# EAGLE design transponder_2018_v3 (EAGLE 9.1.3)
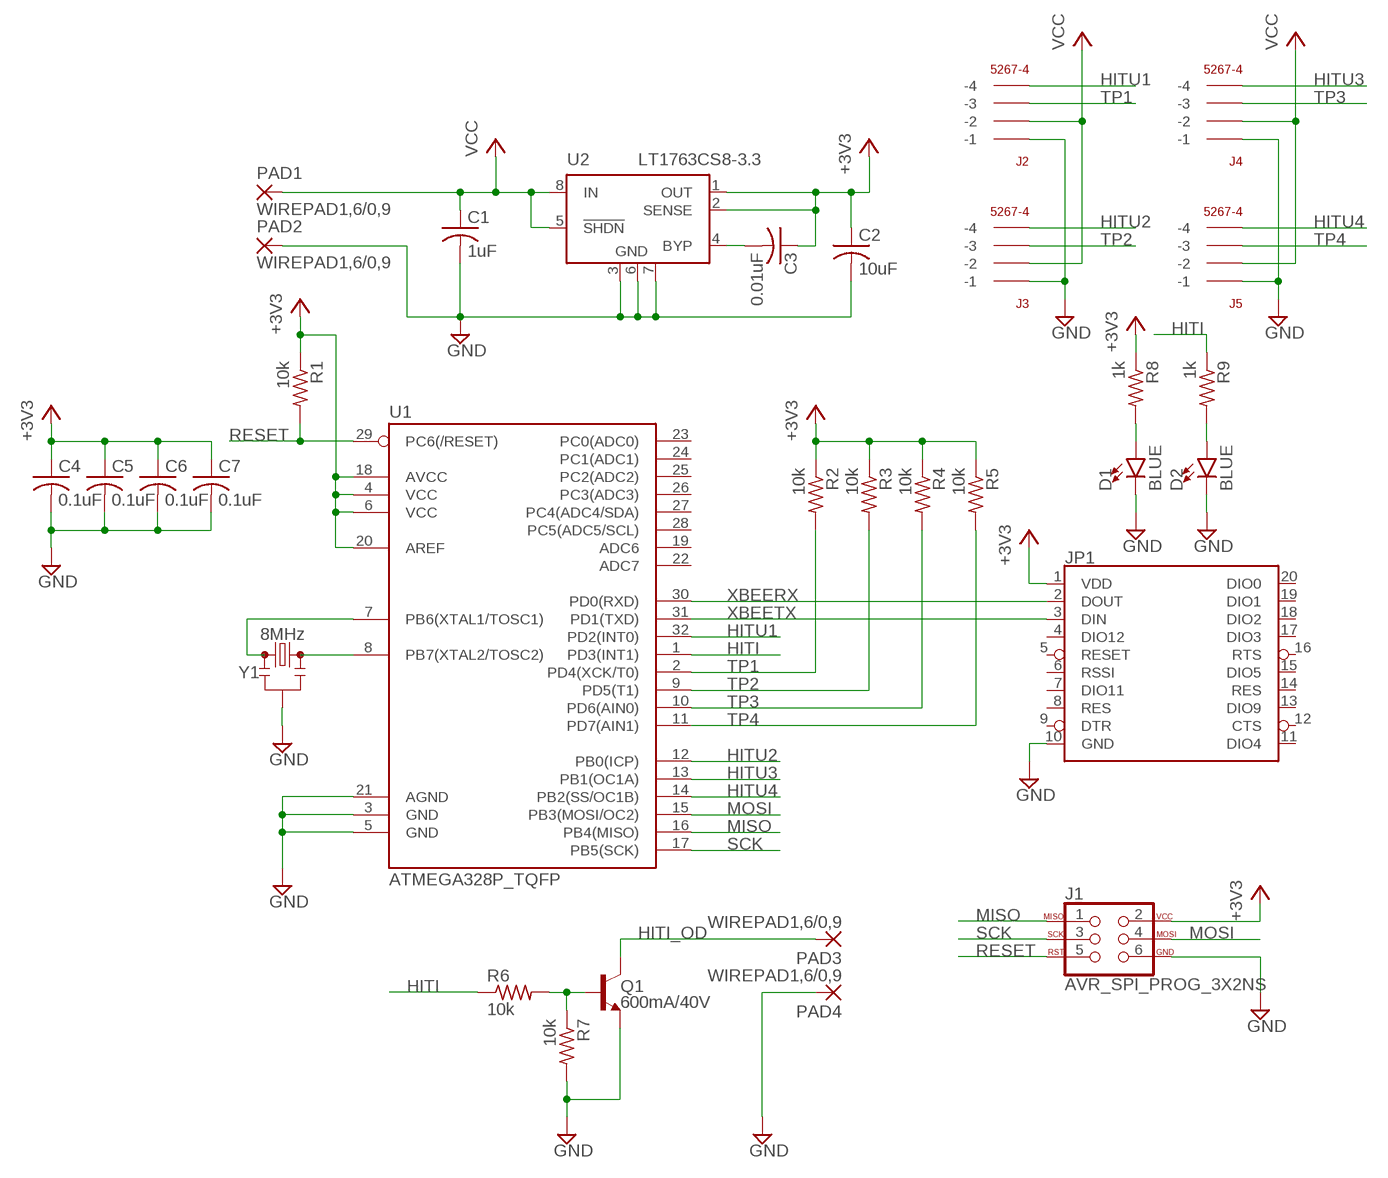
[diagram p0: schematic, sheet 1]

## Parts
C1  1uF  C-USC0603  [C0603]
C2  10uF  C-USC1206  [C1206]
C3  0.01uF  C-USC0603  [C0603]
C4  0.1uF  C-USC0603  [C0603]
C5  0.1uF  C-USC0603  [C0603]
C6  0.1uF  C-USC0603  [C0603]
C7  0.1uF  C-USC0603  [C0603]
D1  BLUE  LED-BLUE0603  [LED-0603]
D2  BLUE  LED-BLUE0603  [LED-0603]
J1  AVR_SPI_PROG_3X2NS  [2X3-NS]
J2  5267-4  [5267-4]
J3  5267-4  [5267-4]
J4  5267-4  [5267-4]
J5  5267-4  [5267-4]
JP1  XBEESMD  [XBEE-SMD]
PAD1  WIREPAD1,6/0,9  [1,6/0,9]
PAD2  WIREPAD1,6/0,9  [1,6/0,9]
PAD3  WIREPAD1,6/0,9  [1,6/0,9]
PAD4  WIREPAD1,6/0,9  [1,6/0,9]
Q1  600mA/40V  TRANS_NPN-MMBT2222AL  [SOT23-3]
R1  10k  R-US_R0603  [R0603]
R2  10k  R-US_R0603  [R0603]
R3  10k  R-US_R0603  [R0603]
R4  10k  R-US_R0603  [R0603]
R5  10k  R-US_R0603  [R0603]
R6  10k  R-US_R0603  [R0603]
R7  10k  R-US_R0603  [R0603]
R8  1k  R-US_R0603  [R0603]
R9  1k  R-US_R0603  [R0603]
U1  ATMEGA328P_TQFP  [TQFP32-08]
U2  LT1763CS8-3.3  [SOIC8]
Y1  8MHz  RESONATOR-8MHZSMD_3.2X1.3  [RESONATOR-SMD-3.2X1.3]

## Nets
+3V3: C2.1 C3.1 C4.1 C5.1 C6.1 C7.1 J1.2 JP1.1(VDD) R1.1 R2.1 R3.1 R4.1 R5.1 R8.1 U1.4(VCC) U1.6(VCC) U1.18(AVCC) U1.20(AREF) U2.1(OUT) U2.2(SENSE)
GND: C1.2 C2.2 C4.2 C5.2 C6.2 C7.2 D1.C D2.C J1.6 J2.P$1(-1) J3.P$1(-1) J4.P$1(-1) J5.P$1(-1) JP1.10(GND) PAD2.1(P) PAD4.1(P) Q1.2(E) R7.2 U1.3(GND) U1.5(GND) U1.21(AGND) U2.3(GND) U2.6(GND) U2.7(GND) Y1.2
HITI: R6.1 R9.1 U1.1(PD3(INT1))
HITI_OD: PAD3.1(P) Q1.3(C)
HITU1: J2.P$4(-4) U1.32(PD2(INT0))
HITU2: J3.P$4(-4) U1.12(PB0(ICP))
HITU3: J4.P$4(-4) U1.13(PB1(OC1A))
HITU4: J5.P$4(-4) U1.14(PB2(SS/OC1B))
MISO: J1.1 U1.16(PB4(MISO))
MOSI: J1.4 U1.15(PB3(MOSI/OC2))
N$1: U1.8(PB7(XTAL2/TOSC2)) Y1.3
N$2: U1.7(PB6(XTAL1/TOSC1)) Y1.1
N$3: D1.A R8.2
N$4: Q1.1(B) R6.2 R7.1
N$5: D2.A R9.2
N$6: C3.2 U2.4(BYP)
RESET: J1.5 R1.2 U1.29(PC6(/RESET))
SCK: J1.3 U1.17(PB5(SCK))
TP1: J2.P$3(-3) R2.2 U1.2(PD4(XCK/T0))
TP2: J3.P$3(-3) R3.2 U1.9(PD5(T1))
TP3: J4.P$3(-3) R4.2 U1.10(PD6(AIN0))
TP4: J5.P$3(-3) R5.2 U1.11(PD7(AIN1))
VCC: C1.1 J2.P$2(-2) J3.P$2(-2) J4.P$2(-2) J5.P$2(-2) PAD1.1(P) U2.5(!SHDN) U2.8(IN)
XBEERX: JP1.2(DOUT) U1.30(PD0(RXD))
XBEETX: JP1.3(DIN) U1.31(PD1(TXD))
Unconnected: JP1.4(DIO12) JP1.5(RESET) JP1.6(RSSI) JP1.7(DIO11) JP1.8(RES) JP1.9(DTR) JP1.11(DIO4) JP1.12(CTS) JP1.13(DIO9) JP1.14(RES) JP1.15(DIO5) JP1.16(RTS) JP1.17(DIO3) JP1.18(DIO2) JP1.19(DIO1) JP1.20(DIO0) U1.19(ADC6) U1.22(ADC7) U1.23(PC0(ADC0)) U1.24(PC1(ADC1)) U1.25(PC2(ADC2)) U1.26(PC3(ADC3)) U1.27(PC4(ADC4/SDA)) U1.28(PC5(ADC5/SCL))

## Library data of the parts
C1-C7 = resistor:C-US: CAPACITOR, American symbol
D1 D2 = SparkFun-LED:LED-BLUE: Blue SMD LED Used in manufacturing of various products at SparkFun Packages: 0603 - SMD 0603 package [Product Link] <http://www.digikey.com/product-detail/en/SMLE12BC7TT86/511-1589-2-ND/1641808> 1206 - SMD1206 package [Product Link] <http://www.digikey.com/product-detail/en/lite-on-inc/LTST-C150TBKT/160-1643-1-ND/573584> SparkFun Products: ESP8266 Thing-Dev Board <https://www.sparkfun.com/products/13711> RedBoard <https://www.sparkfun.com/products/12757>; PROD_ID: DIO-08575
J1 = SparkFun-Connectors:AVR_SPI_PROG_3X2: AVR ISP 6 Pin This is the reduced ISP connector for AVR programming. Common on Arduino. This footprint will take up less PCB space and can be used with a 10-pin to 6-pin adapter such as SKU: BOB-08508 **Special note about "TEST_POINT" package. The stop mask is on the top side, so if you want your programming test points to be on the bottom of your board, make sure to place this package on the bottom side of the board. This also ensure that the orientation to program from the bottom side will be correct. SparkFun Products: SparkFun ISP Pogo Adapter <https://www.sparkfun.com/products/11591> - NS Tiny AVR Programmer <https://www.sparkfun.com/products/11801> -PTH
J2-J5 = con-molex-spox:5267-4
JP1 = SparkFun-RF:XBEE: Digi XBee and XBee Pro XBees are tiny blue chips that can communicate wirelessly with each other. They can do simple things, like replacing a couple of wires in serial communication, which is nice when you want to make a remote for your paintball vehicle. SparkFun Products SparkFun XBee Buying Guide <https://www.sparkfun.com/pages/xbee_guide> SparkFun XBee Explorer USB <https://www.sparkfun.com/products/11812> (WRL-11812) Breakout Board for XBee Module <https://www.sparkfun.com/products/8276> (WRL-8276) SparkFun XBee Explorer Regulated <https://www.sparkfun.com/products/11373> (WRL-11373) SparkFun XBee Explorer Dongle <https://www.sparkfun.com/products/11697> (WRL-11697) SparkFun XBee Shield <https://www.sparkfun.com/products/12847> (WRL-12847) SparkFun XBee Explorer Serial <https://www.sparkfun.com/products/13225> (WRL-13225); PROD_ID: CONN-09042
PAD1-PAD4 = wirepad:WIREPAD: Wire PAD connect wire on PCB
Q1 = SparkFun-DiscreteSemi:TRANS_NPN: NPN transistor Current controlled devices typically used to amplify current or used as a switch. BC547 - COM-08928 <http://www.sparkfun.com/products/8928> (TO-92 45V 100mA) (1.Collector 2.Base 3.Emitter) 2N3904 - COM-00521 <http://www.sparkfun.com/products/521> (TO-92 40V 200mA) (1.Emitter 2.Base 3.Collector) P2N2222A - COM-12852 <http://www.sparkfun.com/products/12852> (TO-92 40V 600mA) (1.Collector 2.Base 3.Emitter); PROD_ID: TRANS-08049
R1-R9 = rcl:R-US_: RESISTOR, American symbol
U1 = SparkFun-IC-Microcontroller:ATMEGA328P_TQFP: Popular 328P in QFP Storefront component: ATmega328 - TQFP <https://www.sparkfun.com/products/13448> (COM-13448) Datasheet <http://www.sparkfun.com/datasheets/Components/SMD/ATMega328.pdf> SparkFun Products SparkFun RedBoard - Programmed with Arduino <https://www.sparkfun.com/products/12757> (DEV-12757) Arduino Pro Mini 328 - 5V/16MHz <https://www.sparkfun.com/products/11113> (DEV-11113) Arduino Pro Mini 328 - 3.3V/8MHz <https://www.sparkfun.com/products/11114> (DEV-11114) SparkFun OpenLog <https://www.sparkfun.com/products/13712> (DEV-13712) SparkFun MicroView - OLED Arduino Module <https://www.sparkfun.com/products/12923> (DEV-12923) SparkFun Digital Sandbox <https://www.sparkfun.com/products/12651> (DEV-12651) SparkFun PicoBoard <https://www.sparkfun.com/products/11888> (WIG-11888) Arduino Fio <https://www.sparkfun.com/products/10116> (DEV-10116) LilyPad Arduino 328 Main Board <https://www.sparkfun.com/products/13342> (DEV-13342) SparkFun RedStick <https://www.sparkfun.com/products/13741> (DEV-13741) LilyPad MP3 <https://www.sparkfun.com/products/11013> (DEV-11013) LilyPad Arduino SimpleSnap <https://www.sparkfun.com/products/10941> (DEV-10941) SparkFun Stepoko <https://www.sparkfun.com/products/13899> (ROB-13899) SparkFun Geiger Counter <https://www.sparkfun.com/products/11345> (SEN-11345) SparkFun EL Sequencer <https://www.sparkfun.com/products/12781> (COM-12781) Arduino Pro 328 - 5V/16MHz <https://www.sparkfun.com/products/10915> (DEV-10915) CryptoCape <https://www.sparkfun.com/products/12773> (DEV-12773) SparkFun IR Thermometer Evaluation Board - MLX90614 <https://www.sparkfun.com/products/10740> (SEN-10740) SparkFun RedBot Mainboard <https://www.sparkfun.com/products/12097> (ROB-12097) Arduino Pro 328 - 3.3V/8MHz <https://www.sparkfun.com/products/10914> (DEV-10914) SparkFun Block for Intel® Edison - Arduino <https://www.sparkfun.com/products/13036> (DEV-13036) SparkFun Simon Says - Surface Mount Soldering Kit <https://www.sparkfun.com/products/10935> (KIT-10935) SparkFun 7-Segment Serial Display - Red <https://www.sparkfun.com/products/11441> (COM-11441) SparkFun 7-Segment Serial Display - White <https://www.sparkfun.com/products/11629> (COM-11629) SparkFun 7-Segment Serial Display - Yellow <https://www.sparkfun.com/products/11443> (COM-11443) SparkFun 7-Segment Serial Display - Kelly Green <https://www.sparkfun.com/products/11440> (COM-11440) SparkFun 7-Segment Serial Display - Blue <https://www.sparkfun.com/products/11442> (COM-11442) SparkFun OpenSegment Serial Display - 20mm (Blue) <https://www.sparkfun.com/products/11647> (COM-11647) SparkFun OpenSegment Serial Display - 20mm (Green) <https://www.sparkfun.com/products/11646> (COM-11646) SparkFun OpenSegment Serial Display - 20mm (White) <https://www.sparkfun.com/products/11648> (COM-11648) SparkFun OpenSegment Serial Display - 20mm (Red) <https://www.sparkfun.com/products/11644> (COM-11644) SparkFun OpenSegment Serial Display - 20mm (Yellow) <https://www.sparkfun.com/products/11645> (COM-11645) SparkFun OpenSegment Shield <https://www.sparkfun.com/products/13190> (DEV-13190); PROD_ID: IC-09069
U2 = linear-technology:LT1763CS8: 500mA, Low Noise, LDO Micropower Regulators Source: http://cds.linear.com/docs/Datasheet/1763ff.pdf; MPN: LT1763CS8-3.3; OC_FARNELL: 1273617; OC_NEWARK: 57M6055
Y1 = SparkFun-Clocks:RESONATOR-8MHZ: 8MHz Resonator Digikey Example <http://www.digikey.com/product-detail/en/murata-electronics-north-america/CSTCE10M0G55-R0/490-1196-1-ND/584633> Frequency: 8MHz Frequency Stability: ±0.2% Frequency Tolerance: ±0.5% Capacitance: 33pF SparkFun Products Arduino Pro Mini 328- 3.3V/8MHz <https://www.sparkfun.com/products/11114> SparkFun Digital Sandbox <https://www.sparkfun.com/products/12651>; PROD_ID: XTAL-08895

## Board
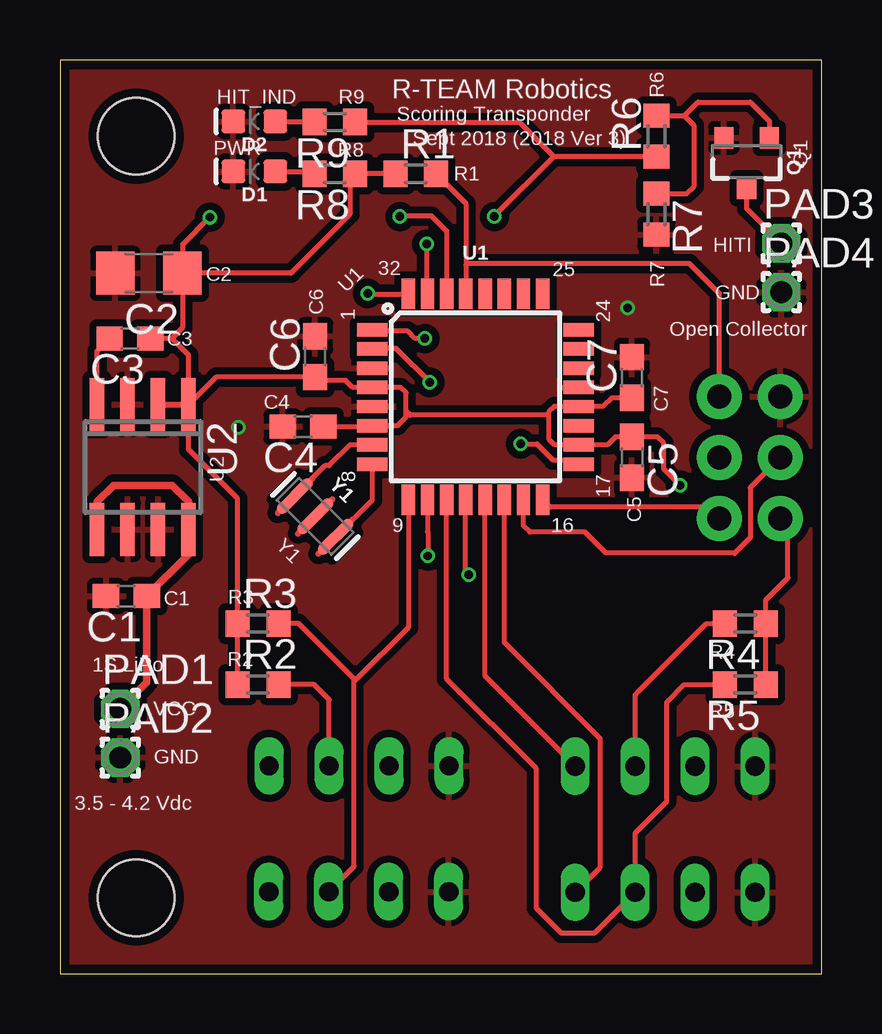
[diagram p1: board, top side]
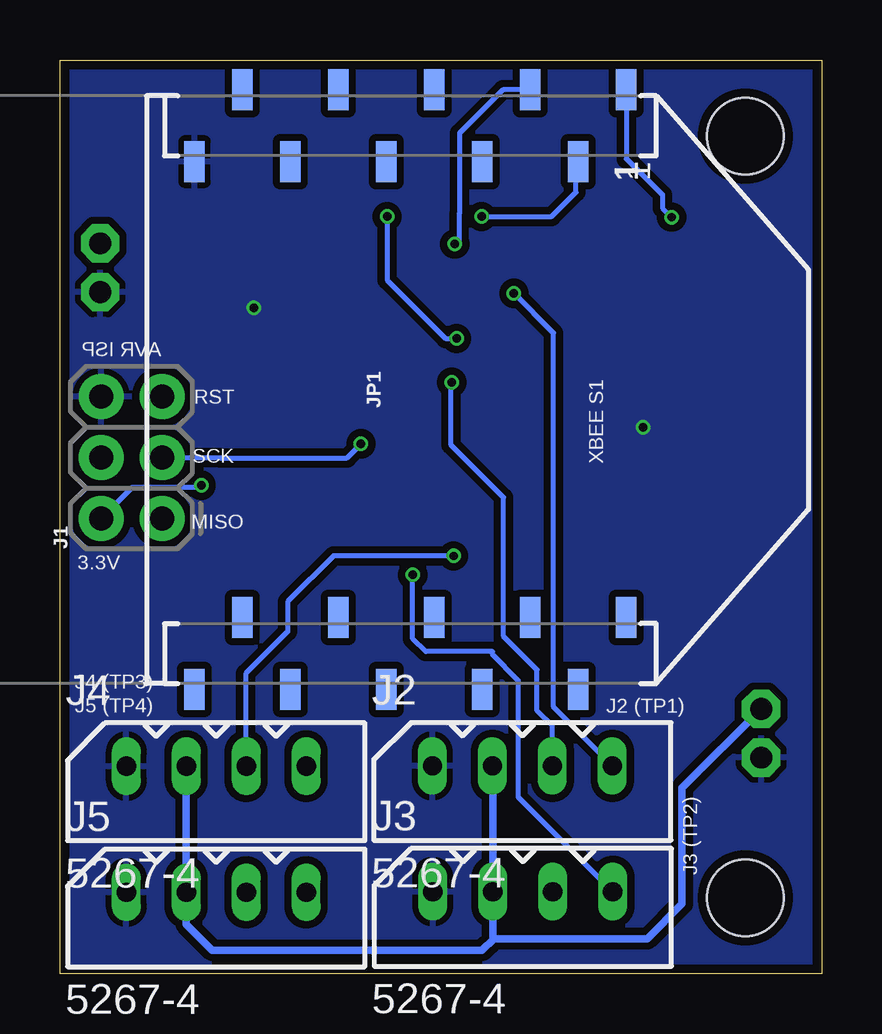
[diagram p2: board, bottom side, seen from below]

Size 31.75 x 38.1 mm. Coordinates in mm from the lower left corner, seen from the top.
Outline: 0,0 31.75,0 31.75,38.1 0,38.1 0,0
Copper layers (1*16): Top 0.035559375mm / dielectric 1.6mm / Bottom 0.035559375mm
Design rules "oshpark-2layer": minimum track width 6mil, minimum drill 10mil, track to track 6mil, track to pad 6mil, pad to pad 6mil, via to via 6mil, smd to smd 6mil, copper to edge 15mil, drill to drill 6mil, minimum pad ring 5mil, minimum via ring 5mil, stop-mask expansion 2.5mil, vias tented up to drill 0mil, thermal gap 10mil
Holes 3.2 mm at 3.17,3.17 3.17,34.92

### Footprints (pad centres in the part's own frame; a part is rotated, then mirrored left to right if it is on the bottom)
C0603 = smd 1.1 x 1: 1 -0.85,0; 2 0.85,0
C1206 = smd 1.6 x 1.8: 1 -1.4,0; 2 1.4,0
LED-0603 = smd 1 x 1: A -0.877,0; C 0.877,0
2X3-NS = drill 1.016 pad 1.88: 1 -2.54,-1.27; 2 -2.54,1.27; 3 0,-1.27; 4 0,1.27; 5 2.54,-1.27; 6 2.54,1.27
5267-4 = drill 0.8 long: P$1 0,0; P$2 2.5,0; P$3 5,0; P$4 7.5,0
XBEE-SMD = smd 1.7 x 0.85: 1 -12.5,20; 2 -9.5,18; 3 -12.5,16; 4 -9.5,14; 5 -12.5,12; 6 -9.5,10; 7 -12.5,8; 8 -9.5,6; 9 -12.5,4; 10 -9.5,2; 11 12.5,2; 12 9.5,4; 13 12.5,6; 14 9.5,8; 15 12.5,10; 16 9.5,12; 17 12.5,14; 18 9.5,16; 19 12.5,18; 20 9.5,20
1,6/0,9 = drill 0.914 pad 1.6 octagon: 1 0,0
SOT23-3 = smd 0.8 x 0.9: 1 -0.95,-1; 2 0.95,-1; 3 0,1.1
R0603 = smd 1 x 1.1: 1 -0.85,0; 2 0.85,0
TQFP32-08 = smd 1.27 x 0.559: 1 -4.293,2.8; 2 -4.293,2; 3 -4.293,1.2; 4 -4.293,0.4; 5 -4.293,-0.4; 6 -4.293,-1.2; 7 -4.293,-2; 8 -4.293,-2.8; 17 4.293,-2.8; 18 4.293,-2; 19 4.293,-1.2; 20 4.293,-0.4; 21 4.293,0.4; 22 4.293,1.2; 23 4.293,2; 24 4.293,2.8 | smd 0.559 x 1.27: 9 -2.8,-4.293; 10 -2,-4.293; 11 -1.2,-4.293; 12 -0.4,-4.293; 13 0.4,-4.293; 14 1.2,-4.293; 15 2,-4.293; 16 2.8,-4.293; 25 2.8,4.293; 26 2,4.293; 27 1.2,4.293; 28 0.4,4.293; 29 -0.4,4.293; 30 -1.2,4.293; 31 -2,4.293; 32 -2.8,4.293
SOIC8 = smd 0.6 x 2.2: 1 -1.905,-2.6; 2 -0.635,-2.6; 3 0.635,-2.6; 4 1.905,-2.6; 5 1.905,2.6; 6 0.635,2.6; 7 -0.635,2.6; 8 -1.905,2.6
RESONATOR-SMD-3.2X1.3 = smd 0.45 x 1.905: 1 -1.2,0; 2 0,0; 3 1.2,0

### Placement (x,y rotation side)
C1  2.77,15.75 180 top
C2  3.71,29.21 180 top
C3  2.92,26.49 180 top
C4  10.13,22.81 180 top
C5  23.85,21.54 270 top
C6  10.64,25.73 90 top
C7  23.85,24.87 90 top
D1  8.1,33.45 180 top
D2  8.1,35.53 180 top
J1  28.76,21.53 90 bottom
J2  16.22,8.67 0 bottom
J3  16.21,3.43 0 bottom
J4  28.98,8.66 0 bottom
J5  28.98,3.4 0 bottom
JP1  28.14,24.36 270 bottom
PAD1  2.51,11.05 0 top
PAD2  2.51,9.02 0 top
PAD3  30.07,30.45 0 top
PAD4  30.07,28.42 0 top
Q1  28.63,33.86 180 top
R1  14.83,33.35 0 top
R2  8.26,12.06 0 top
R3  8.26,14.61 0 top
R4  28.57,14.61 180 top
R5  28.57,12.06 180 top
R6  24.87,34.92 90 top
R7  24.87,31.67 270 top
R8  11.46,33.35 180 top
R9  11.46,35.51 180 top
U1  17.32,24.05 0 top
U2  3.45,21.13 180 top
Y1  10.64,19.08 315 top

### Tracks (layer width: path | path; a pad name or v marks a point on that pad's centre or on a via)
+3V3  (via drill 0.35)
  Top 0.203: U2.1 5.36,25.81 4.67,26.49 4.65,26.49 | 4.65,26.49 C3.1 | C2.1 5.11,26.95 4.65,26.49 | C7.1 23,24.02 22.64,23.65 U1.20 20.61,23.65 20.37,23.42 20.37,23.29 | 20.37,23.29 20.37,22.3 20.6,22.07 21.6,22.07 U1.18 22.82,22.05 23.15,22.39 C5.1 24.91,22.39 25.17,22.12 25.17,21.06 v25.86,20.37 | U2.1 6.51,24.88 C6.1 10.78,24.74 11.91,24.74 12.2,24.45 U1.4 14.21,24.45 14.43,24.23 14.43,23.47 | C4.1 12.99,22.81 U1.6 14.06,22.85 14.43,23.22 14.43,23.47 | R5.1 R4.1 29.43,15.58 30.35,16.51 30.35,18.66 J1.2 | R2.1 R3.1 7.41,19.82 5.36,21.87 U2.1 | C2.1 9.63,29.21 12.09,31.67 12.09,33.13 R8.1 R1.1 | v6.25,31.55 5.11,30.41 C2.1 | 20.37,23.29 14.61,23.29 14.43,23.47
  Top 0.254: U2.2 U2.1
  Bottom 0.203: JP1.1 8.14,33.97 8.13,33.98 6.63,32.49 6.63,31.93 v6.25,31.55 | J1.2 28.72,20.3 25.93,20.3 v25.86,20.37
GND  (via drill 0.35)
  other vias: 23.67,27.76 7.44,22.78
  pour Bottom (isolate 0.305): -0.15,38.25 -0.15,-0.13 -0.03,-0.25 31.88,-0.25 31.98,-0.36 31.98,38.18 31.9,38.25 -0.1,38.25
  pour Top (isolate 0.305): -0.15,38.28 31.85,38.28 31.9,38.23 31.9,-0.05 31.95,-0.1 -0.08,-0.1 -0.23,-0.25 -0.23,38.2
HITI  (via drill 0.35)
  Top 0.203: R6.1 20.59,34.08 | R9.1 12.33,35.48 19.18,35.48 20.59,34.08 | v18.11,31.57 18.11,31.65 18.16,31.65 20.59,34.08 | v15.21,26.49 14.81,26.49 14.5,26.8 13.09,26.8 U1.1
  Bottom 0.203: v18.11,31.57 18.11,28.93 15.67,26.49 v15.21,26.49
HITI_OD
  Top 0.203: PAD3.1 28.63,31.9 Q1.3
HITU1  (via drill 0.35)
  Top 0.203: v12.83,28.37 12.85,28.35 U1.32
  Bottom 0.203: J2.P$4 11.18,11.13 11.18,26.72 v12.83,28.37
HITU2  (via drill 0.35)
  Top 0.203: U1.12 16.92,16.76 v17.04,16.64
  Bottom 0.203: v17.04,16.64 17.04,13.97 16.51,13.44 13.72,13.44 13.72,13.31 12.65,12.24 12.65,7.37 J3.P$4
HITU3
  Top 0.203: J4.P$4 17.72,12.42 U1.13
HITU4
  Top 0.203: J5.P$4 22.53,4.45 22.53,9.8 18.52,13.81 U1.14
MISO
  Top 0.203: J1.1 27.02,19.46 20.43,19.46 U1.16
MOSI
  Top 0.203: J1.4 28.78,20.27 28.78,18.19 28.12,17.53 28.09,17.55 22.76,17.55 21.89,18.41 19.58,18.41 19.32,18.68 U1.15
N$1
  Top 0.203: Y1.3 13.03,19.77 U1.8
N$2
  Top 0.203: U1.7 12.1,22.05 11.23,21.18 11.05,21.18 Y1.1
N$3
  Top 0.203: D1.A 10.5,33.45 R8.2
N$4
  Top 0.203: R6.2 26.02,35.77 | 26.02,35.77 26.59,36.35 28.78,36.35 29.58,35.55 Q1.1 | R7.1 26.12,32.52 26.44,32.84 26.44,35.35 26.02,35.77
N$5
  Top 0.203: D2.A 10.58,35.53 R9.2
N$6
  Top 0.203: U2.4 1.55,25.97 C3.2
RESET
  Top 0.203: R1.2 16.92,32.11 16.92,29.54 | 16.92,29.54 U1.29 | J1.5 27.49,28.36 26.24,29.62 17,29.62 16.92,29.54
SCK  (via drill 0.35)
  Top 0.203: U1.17 21.44,21.43 20.55,21.43 19.89,22.1 v19.2,22.1
  Bottom 0.203: J1.3 25.08,21.53 25.07,21.51 19.79,21.51 v19.2,22.1
TP1  (via drill 0.35)
  Top 0.203: J2.P$3 11.22,11.43 10.59,12.06 R2.2 | v15.42,24.66 14.05,26.04 14.05,26.06 U1.2
  Bottom 0.203: J2.P$3 11.22,10.33 11.86,10.97 11.86,12.68 13.26,14.07 13.26,19.86 15.44,22.05 15.44,24.64 v15.42,24.66
TP2
  Top 0.203: J3.P$3 12.27,4.49 12.27,12.19 | R3.2 9.96,14.61 12.27,12.29 12.27,12.19 | U1.9 14.52,14.45 12.27,12.19
TP3  (via drill 0.35)
  Top 0.203: J4.P$3 23.98,11.64 24.14,11.8 26.95,14.61 R4.2 | U1.10 15.32,18.43 15.34,18.41 v15.34,17.42
  Bottom 0.203: v15.34,17.42 20.34,17.42 22.25,15.52 22.25,14.28 24,12.52 24,8.68 J4.P$3
TP4
  Top 0.203: R5.2 26.04,12.06 25.3,11.33 25.3,7.19 23.98,5.87 J5.P$3 22.28,1.7 20.9,1.7 19.86,2.74 19.86,8.56 16.12,12.3 U1.11
VCC
  Top 0.305: PAD1.1 3.62,12.15 C1.1 5.36,17.49 U2.8 5.36,19.68 4.67,20.37 2.23,20.37 1.55,19.68 U2.5
  Bottom 0.305: J3.P$2 13.71,3.48 | 13.71,3.48 13.71,8.66 J2.P$2 | J4.P$2 J5.P$2 26.48,2.07 25.4,0.99 14.15,0.99 13.66,1.47 | 13.66,1.47 13.71,1.51 13.71,3.48 | PAD1.1 5.82,7.75 5.82,2.92 7.26,1.47 13.66,1.47
XBEERX  (via drill 0.35)
  Top 0.203: v14.17,31.57 14.2,31.6 15.49,31.6 16.12,30.97 | 16.12,30.97 | 16.12,30.97 U1.30
  Bottom 0.203: v14.17,31.57 11.25,31.57 10.24,32.59 10.24,33.77 JP1.2
XBEETX  (via drill 0.35)
  Top 0.203: v15.29,30.43 15.29,28.38 U1.31
  Bottom 0.203: JP1.3 13.28,36.86 15.09,35.05 15.09,31.73 15.11,31.7 15.11,30.61 v15.29,30.43

### Text on the board
_tsilk: R6 | HIT_IND | R9 | R-TEAM Robotics | Scoring Transponder | PWR | R8 | Sept 2018 (2018 Ver 3) | Q1 | R1 | HITI | WIREPAD1,6/0,9 | R7 | C2 | 32 | 25 | WIREPAD1,6/0,9 | U1 | 24 | GND | C3 | C6 | 1 | Open Collector | C4 | C7 | U2 | 17 | 8 | C5 | Y1 | 9 | 16 | C1 | R3 | R4 | 1S LiPo | R2 | WIREPAD1,6/0,9 | VCC | R5 | WIREPAD1,6/0,9 | GND | 3.5 - 4.2 Vdc
_bsilk: 1 | AVR ISP | XBEE S1 | RST | SCK | MISO | 3.3V | J4 (TP3) | J2 (TP1) | J5 (TP4) | J3 (TP2)